# EAGLE design nrfusb (EAGLE 6.5.0)
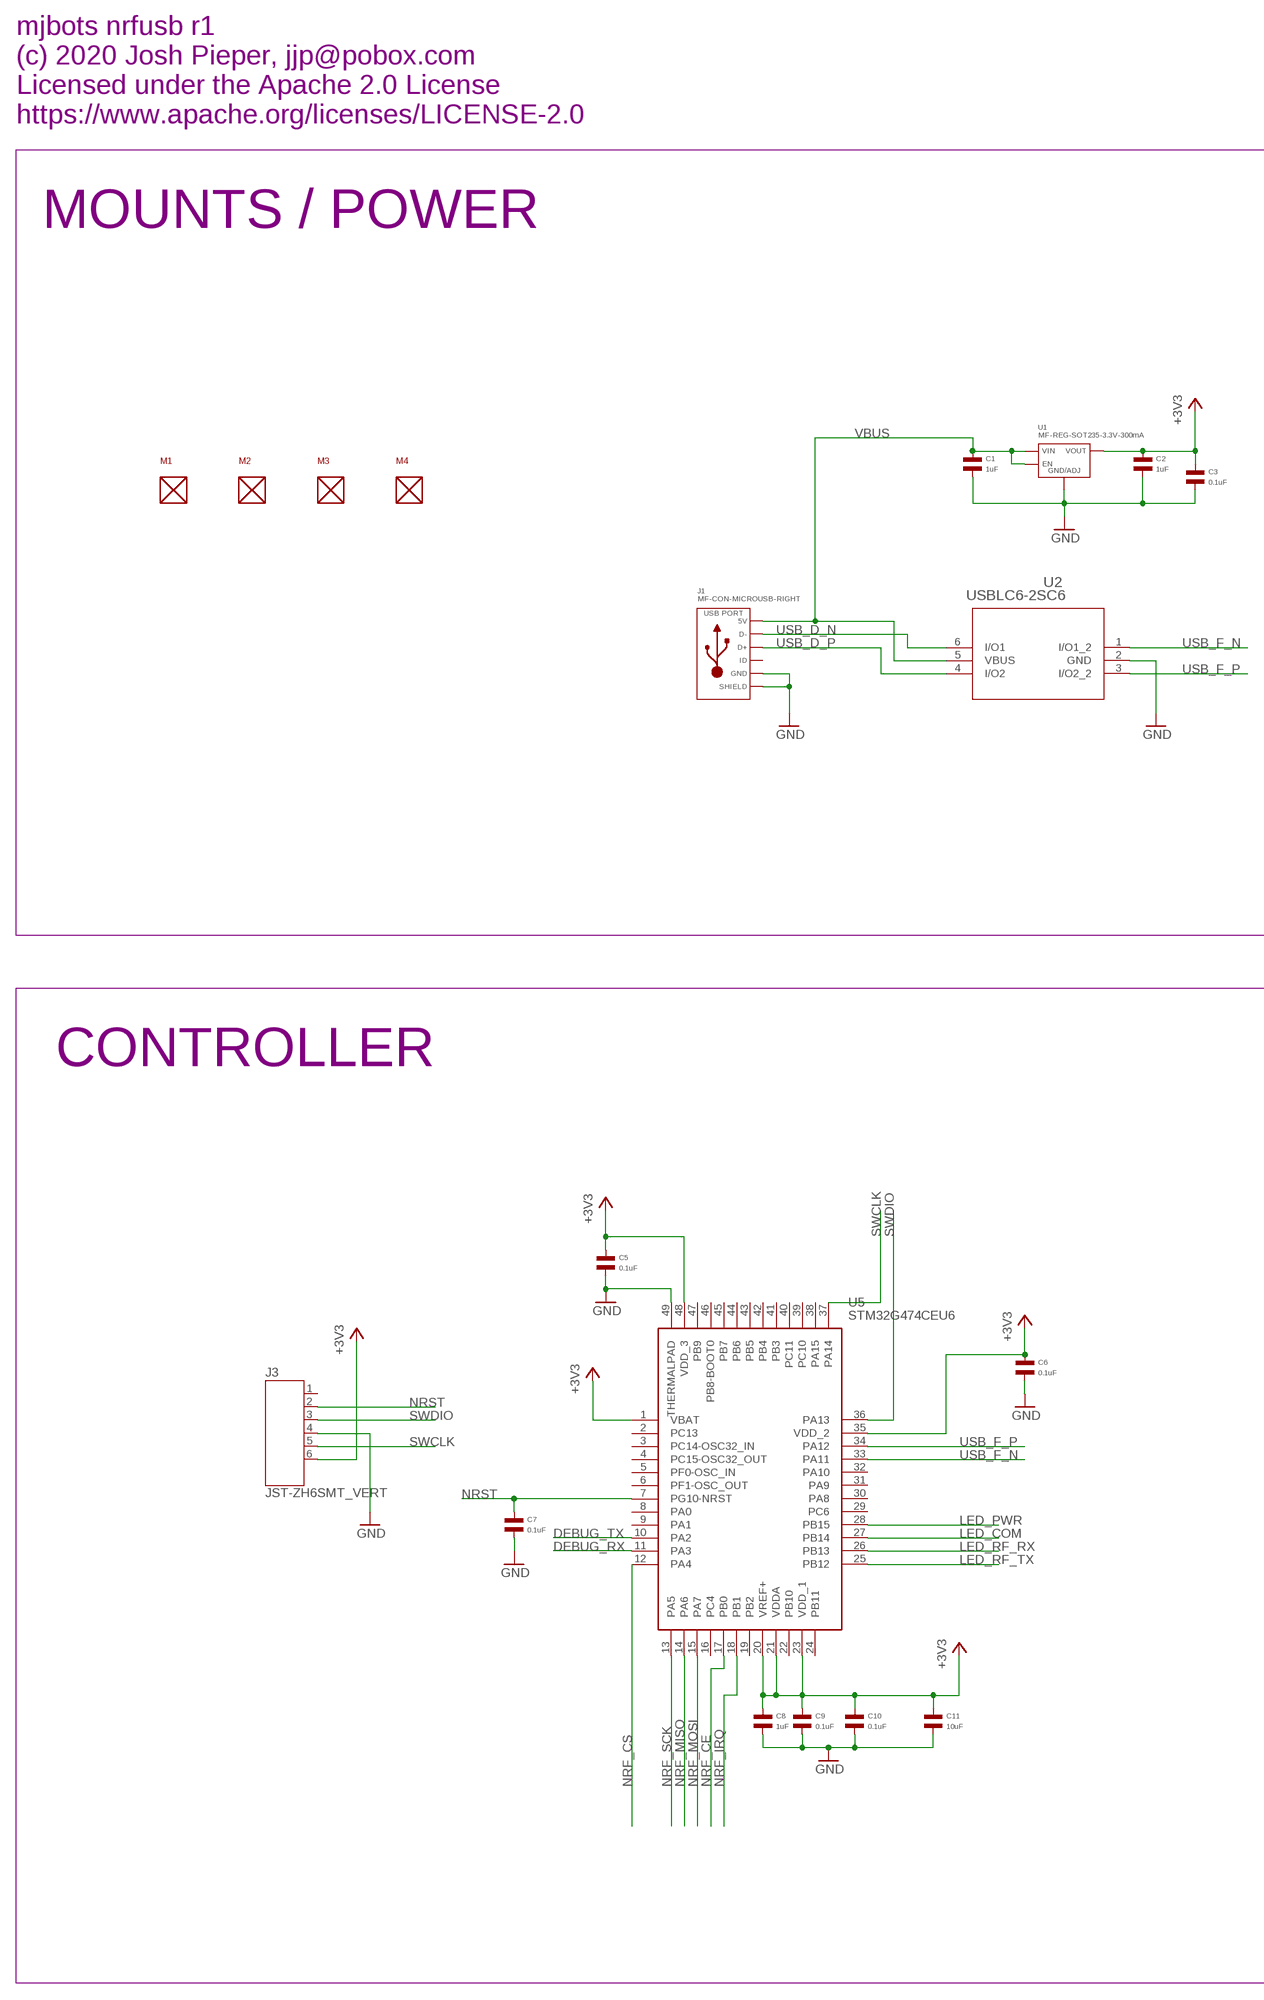
[diagram p0: schematic, sheet 1, part 1 of 2]
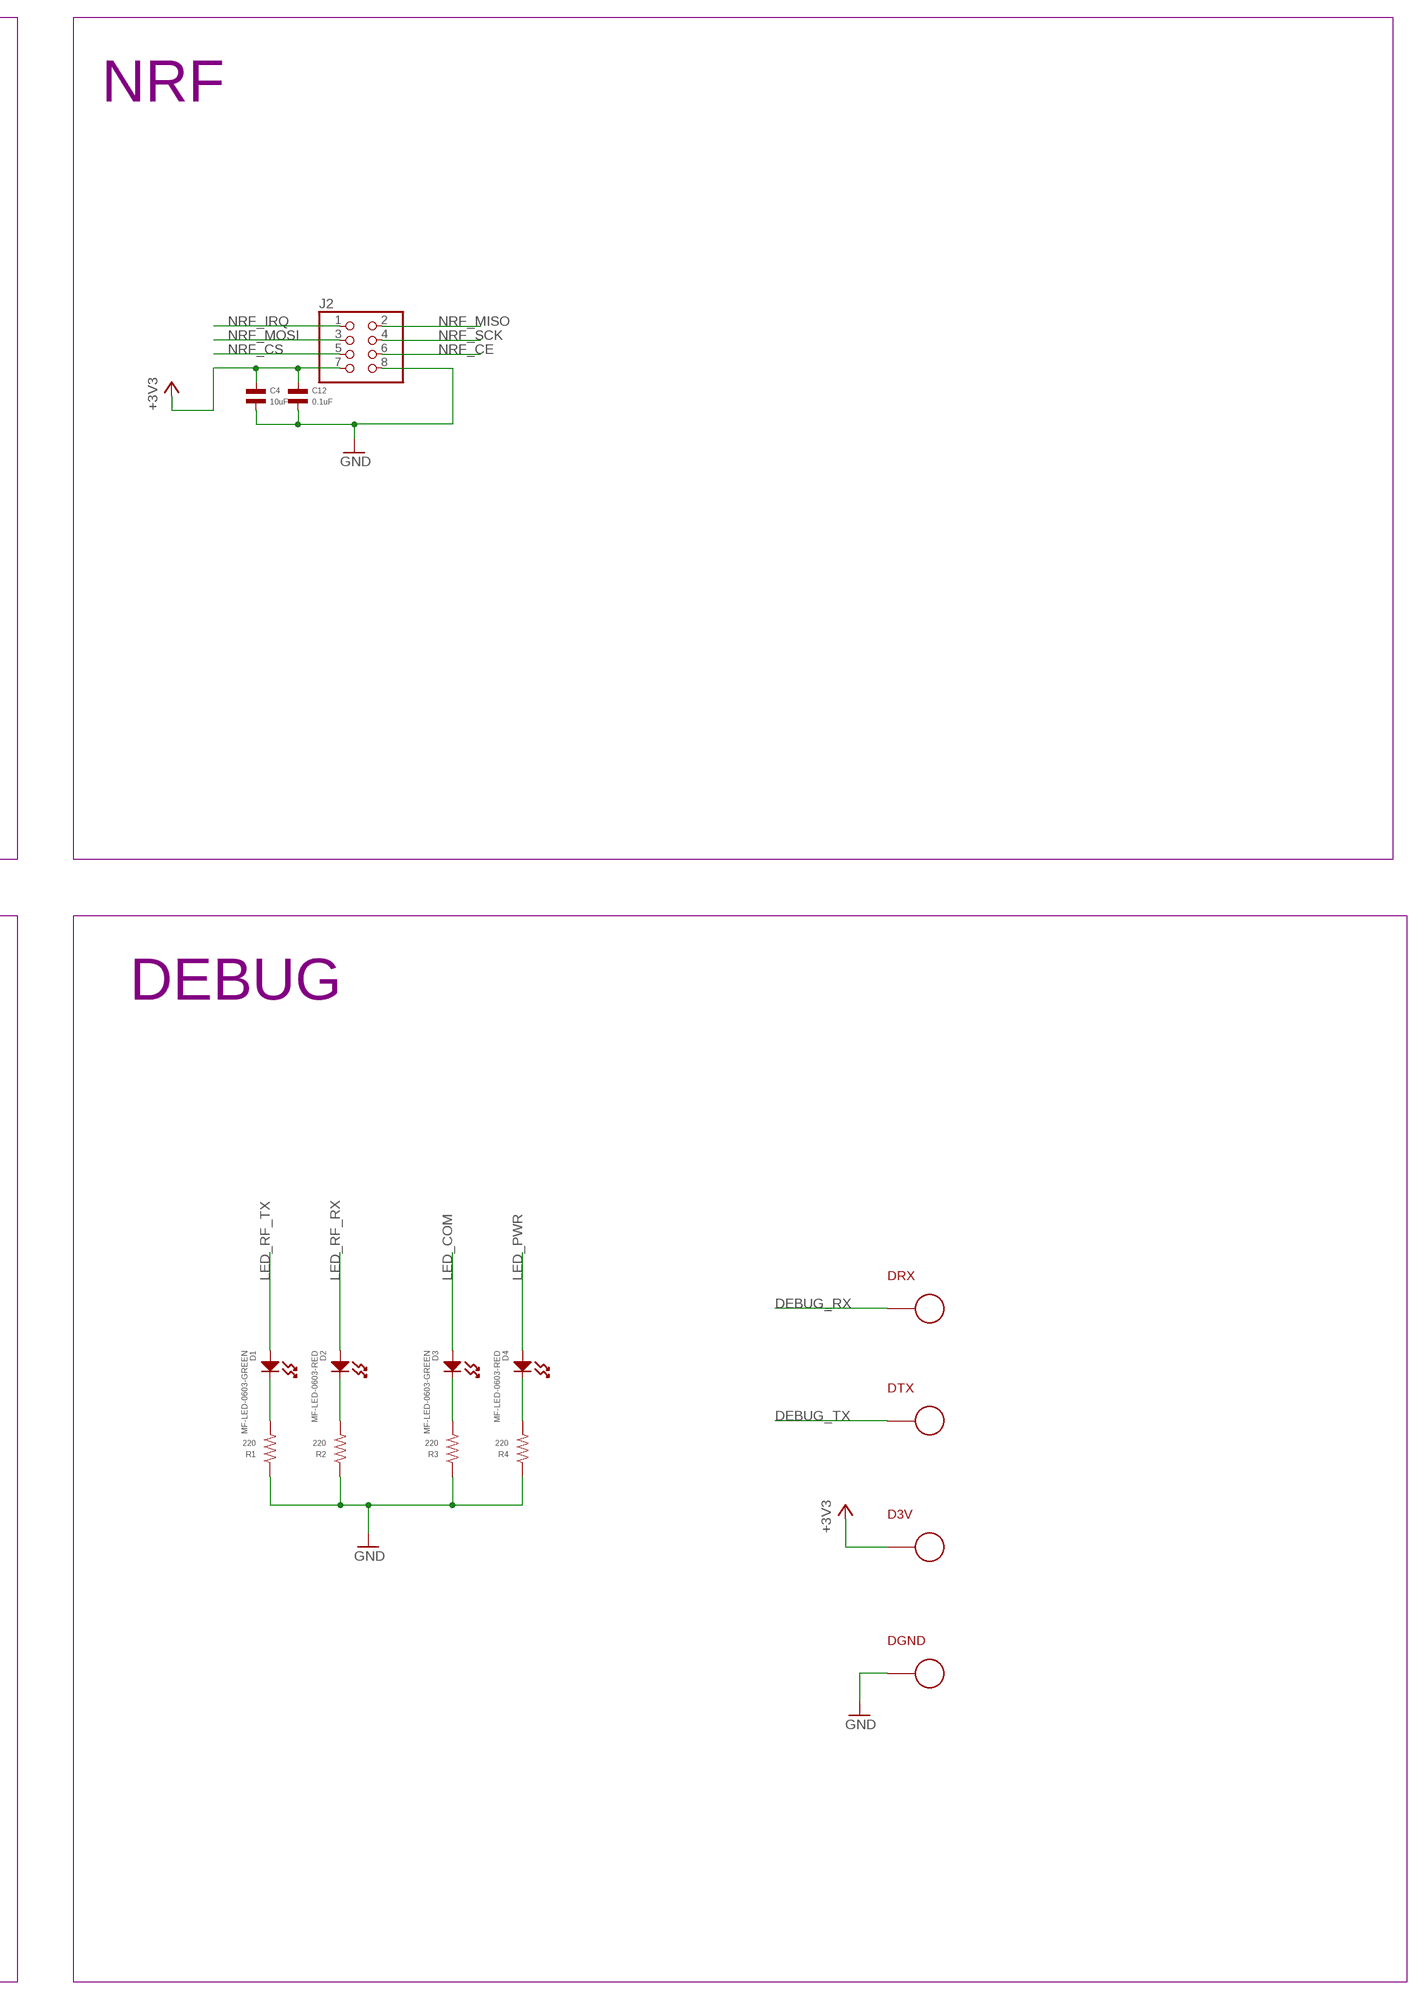
[diagram p1: schematic, sheet 1, part 2 of 2]

## Parts
C1  1uF  CAPACITOR_NP_0603  [C0603]
C2  1uF  CAPACITOR_NP_0603  [C0603]
C3  0.1uF  CAPACITOR_NP_0402  [C0402]
C4  10uF  CAPACITOR_NP_1206  [C1206]
C5  0.1uF  CAPACITOR_NP_0402  [C0402]
C6  0.1uF  CAPACITOR_NP_0402  [C0402]
C7  0.1uF  CAPACITOR_NP_0402  [C0402]
C8  1uF  CAPACITOR_NP_0603  [C0603]
C9  0.1uF  CAPACITOR_NP_0402  [C0402]
C10  0.1uF  CAPACITOR_NP_0402  [C0402]
C11  10uF  CAPACITOR_NP_1206  [C1206]
C12  0.1uF  CAPACITOR_NP_0402  [C0402]
D1  MF-LED-0603-GREEN  LED_SINGLE-0603-GREEN  [LED0603]
D2  MF-LED-0603-RED  LED_SINGLE-0603-RED  [LED0603]
D3  MF-LED-0603-GREEN  LED_SINGLE-0603-GREEN  [LED0603]
D3V  PAD24AWG_PAD  [24AWG_PAD]
D4  MF-LED-0603-RED  LED_SINGLE-0603-RED  [LED0603]
DGND  PAD24AWG_PAD  [24AWG_PAD]
DRX  PAD24AWG_PAD  [24AWG_PAD]
DTX  PAD24AWG_PAD  [24AWG_PAD]
J1  MF-CON-MICROUSB-RIGHT  USB_MICRO_RIGHT  [MICROUSB-RIGHT]
J2  PINHD-2X4  [2X04]
J3  JST-ZH6SMT_VERT  [JST_B6B-ZR-SM4-TF(LF)(SN)]
M1  MOUNT  [M2.5MOUNT]
M2  MOUNT  [M2.5MOUNT]
M3  MOUNT  [M2.5MOUNT]
M4  MOUNT  [M2.5MOUNT]
R1  220  RESISTOR_0402  [R0402]
R2  220  RESISTOR_0402  [R0402]
R3  220  RESISTOR_0402  [R0402]
R4  220  RESISTOR_0402  [R0402]
U1  MF-REG-SOT235-3.3V-300mA  TLV70233PDBVR  [SOT-23-5]
U2  USBLC6-2SC6  [SOT23-6L]
U5  STM32G474CEU6  [QFN50P700X700X60-49N]

## Nets
+3V3: C2.P$1 C3.P$1 C4.P$1 C5.P$1 C6.P$1 C8.P$1 C9.P$1 C10.P$1 C11.P$1 C12.P$1 D3V.P$1 J2.7 J3.6 U1.P$5(VOUT) U5.1(VBAT) U5.20(VREF+) U5.21(VDDA) U5.23(VDD_1) U5.35(VDD_2) U5.48(VDD_3)
DEBUG_RX: DRX.P$1 U5.11(PA3)
DEBUG_TX: DTX.P$1 U5.10(PA2)
GND: C1.P$2 C2.P$2 C3.P$2 C4.P$2 C5.P$2 C6.P$2 C7.P$2 C8.P$2 C9.P$2 C10.P$2 C11.P$2 C12.P$2 DGND.P$1 J1.5(GND) J1.S1(SLD) J1.S2(SLD) J1.S3(SLD) J1.S4(SLD) J1.S5(SLD) J1.S6(SLD) J2.8 J3.4 R1.P$1 R2.P$1 R3.P$1 R4.P$1 U1.P$2(GND/ADJ) U2.2(GND) U5.49(THERMALPAD)
LED_COM: D3.ANODE U5.27(PB14)
LED_PWR: D4.ANODE U5.28(PB15)
LED_RF_RX: D2.ANODE U5.26(PB13)
LED_RF_TX: D1.ANODE U5.25(PB12)
N$3: D1.CATHODE R1.P$2
N$4: D2.CATHODE R2.P$2
N$5: D3.CATHODE R3.P$2
N$6: D4.CATHODE R4.P$2
NRF_CE: J2.6 U5.17(PB0)
NRF_CS: J2.5 U5.12(PA4)
NRF_IRQ: J2.1 U5.18(PB1)
NRF_MISO: J2.2 U5.14(PA6)
NRF_MOSI: J2.3 U5.15(PA7)
NRF_SCK: J2.4 U5.13(PA5)
NRST: C7.P$1 J3.2 U5.7(PG10-NRST)
SWCLK: J3.5 U5.37(PA14)
SWDIO: J3.3 U5.36(PA13)
USB_D_N [usb]: J1.2(D-) U2.6(I/O1)
USB_D_P [usb]: J1.3(D+) U2.4(I/O2)
USB_F_N [usb]: U2.1(I/O1_2) U5.33(PA11)
USB_F_P [usb]: U2.3(I/O2_2) U5.34(PA12)
VBUS: C1.P$1 J1.1(5V) U1.P$1(VIN) U1.P$3(EN) U2.5(VBUS)
Unconnected: J1.4(ID) J3.1 U5.2(PC13) U5.3(PC14-OSC32_IN) U5.4(PC15-OSC32_OUT) U5.5(PF0-OSC_IN) U5.6(PF1-OSC_OUT) U5.8(PA0) U5.9(PA1) U5.16(PC4) U5.19(PB2) U5.22(PB10) U5.24(PB11) U5.29(PC6) U5.30(PA8) U5.31(PA9) U5.32(PA10) U5.38(PA15) U5.39(PC10) U5.40(PC11) U5.41(PB3) U5.42(PB4) U5.43(PB5) U5.44(PB6) U5.45(PB7) U5.46(PB8-BOOT0) U5.47(PB9)

## Notes on the sheet
- mjbots nrfusb r1
  (c) 2020 Josh Pieper, jjp@pobox.com
  Licensed under the Apache 2.0 License
  https://www.apache.org/licenses/LICENSE-2.0
- MOUNTS / POWER | NRF
- CONTROLLER | DEBUG

## Library data of the parts
C1 C2 C8 = mfpassives:CAPACITOR_NP: Library: MF_Passives Description: Device for Non-Polarized Capacitors. Manufacture part number (MPN) can be added via Attributes. Check https://factory.macrofab.com/parts for the house parts list.; HOUSEPART: YES; MPN: MF-CAP-0603-1uF; POPULATE: 1
C3 C5-C7 C9 C10 C12 = mfpassives:CAPACITOR_NP: Library: MF_Passives Description: Device for Non-Polarized Capacitors. Manufacture part number (MPN) can be added via Attributes. Check https://factory.macrofab.com/parts for the house parts list.; HOUSEPART: YES; MPN: MF-CAP-0402-0.1uF; POPULATE: 1
C4 C11 = mfpassives:CAPACITOR_NP: Library: MF_Passives Description: Device for Non-Polarized Capacitors. Manufacture part number (MPN) can be added via Attributes. Check https://factory.macrofab.com/parts for the house parts list.; HOUSEPART: YES; MPN: MF-CAP-1206-10uF; POPULATE: 1
D1 D3 = mfleds:LED_SINGLE: Library: MF_LEDs Description: Device for Single LED Packages. Manufacture part number (MFG#) can be added via Attributes.; HOUSEPART: YES; MPN: MF-LED-0603-GREEN; POPULATE: 1; URL: https://factory.macrofab.com/part/MF-LED-0603-GREEN
D2 D4 = mfleds:LED_SINGLE: Library: MF_LEDs Description: Device for Single LED Packages. Manufacture part number (MFG#) can be added via Attributes.; HOUSEPART: YES; MPN: MF-LED-0603-RED; POPULATE: 1; URL: https://factory.macrofab.com/part/MF-LED-0603-RED
D3V DGND DRX DTX = fdcanusb:PAD; POPULATE: 0
J1 = mfconnectors:USB: Library: MF_Connectors Description: 5 Pin USB Connectors. SLD is the shield connection. Usually tied to ground through a small ferrite bead.; HOUSEPART: YES; MPN: MF-CON-MICROUSB-RIGHT; POPULATE: 1; URL: https://factory.macrofab.com/part/MF-CON-MICROUSB-RIGHT
J2 = pinhead:PINHD-2X4: PIN HEADER; MF: WURTH; MPN: 61300821121; POPULATE: 1
J3 = fdcanusb:JST-ZH6; MF: JST; MPN: B6B-ZR-SM4-TF(LF)(SN); POPULATE: 1
M1-M4 = fdcanusb:MOUNT; POPULATE: 0
R1-R4 = mfpassives:RESISTOR: Library: MF_Passives Description: Device for Resistors. Manufacture part number (MPN), Voltage, Tolerance, and Wattage Rating can be added via Attributes. Check https://factory.macrofab.com/parts for the house parts list.; MPN: MF-RES-0402-220; POPULATE: 1
U1 = mficpower:TLV702: Manufacturer Part #: TLV702 Manufacturer: Texas Instruments Description: LDO Voltage Regulators; HOUSEPART: YES; MPN: MF-REG-SOT235-3.3V-300mA; POPULATE: 1; URL: https://factory.macrofab.com/part/MF-REG-SOT235-3.3V-300mA
U2 = fdcanusb:USBLC6-2SC6; MANUFACTURER_PART_NUMBER: USBLC62SC6; MF: ST; MPN: USBLC6-2SC6; POPULATE: 1; VENDOR: STMicroelectronics
U5 = nrfusb:STM32G474CEU6: STMICROELECTRONICS - STM32G474CEU6 - MCU, 32BIT, 170MHZ, UFQFPN-48 Source: Datasheet <https://componentsearchengine.com/Datasheets/1/STM32G474CEU6.pdf>; DESCRIPTION: STMICROELECTRONICS - STM32G474CEU6 - MCU, 32BIT, 170MHZ, UFQFPN-48; HEIGHT: 0.6mm; MANUFACTURER_NAME: STMicroelectronics; MANUFACTURER_PART_NUMBER: STM32G474CEU6; MF: ST; MOUSER_PART_NUMBER: 511-STM32G474CEU6; MOUSER_PRICE-STOCK: https://www.mouser.com/Search/Refine.aspx?Keyword=511-STM32G474CEU6; MPN: STM32G474CEU6; POPULATE: 1

## Net classes
1 usb: width 0.305 mm, clearance 0.127 mm
2 can: width 0.216 mm, clearance 0.127 mm

## Board
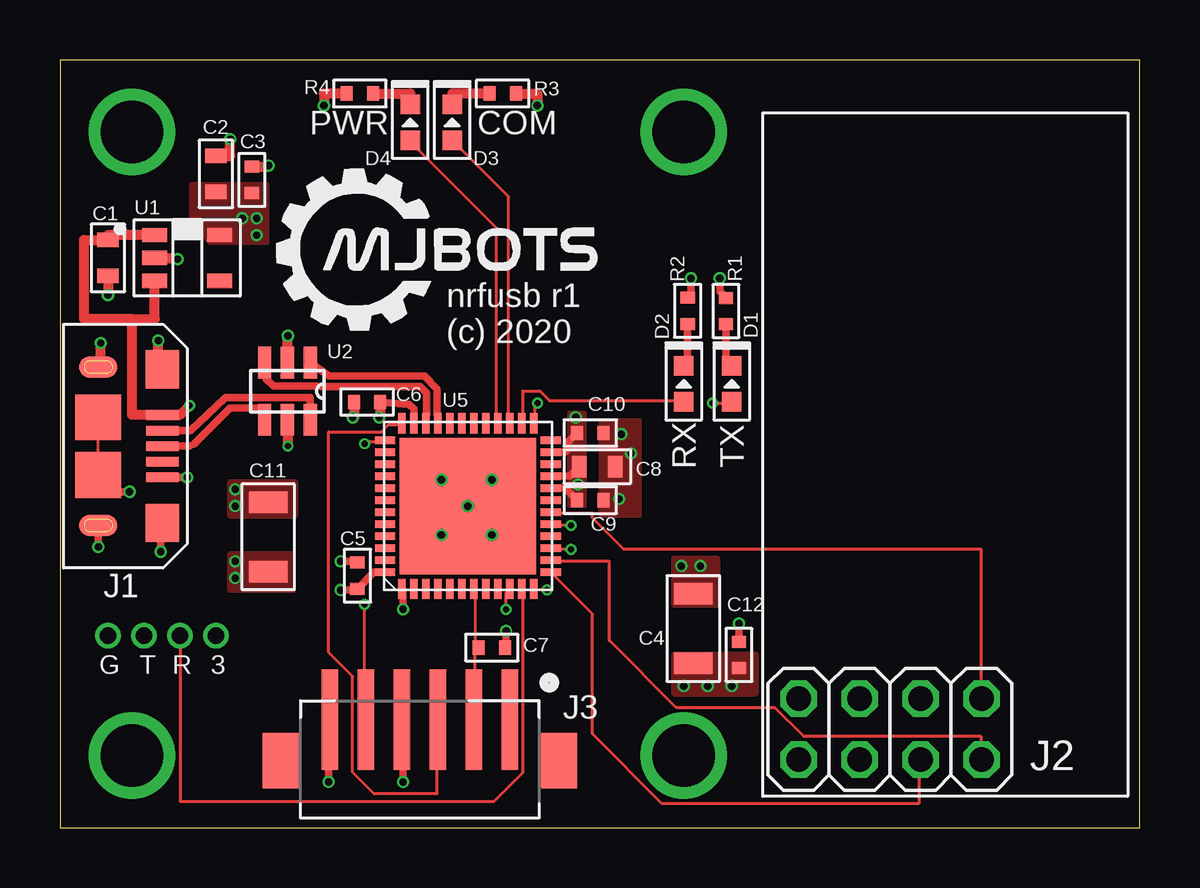
[diagram p2: board, top side]
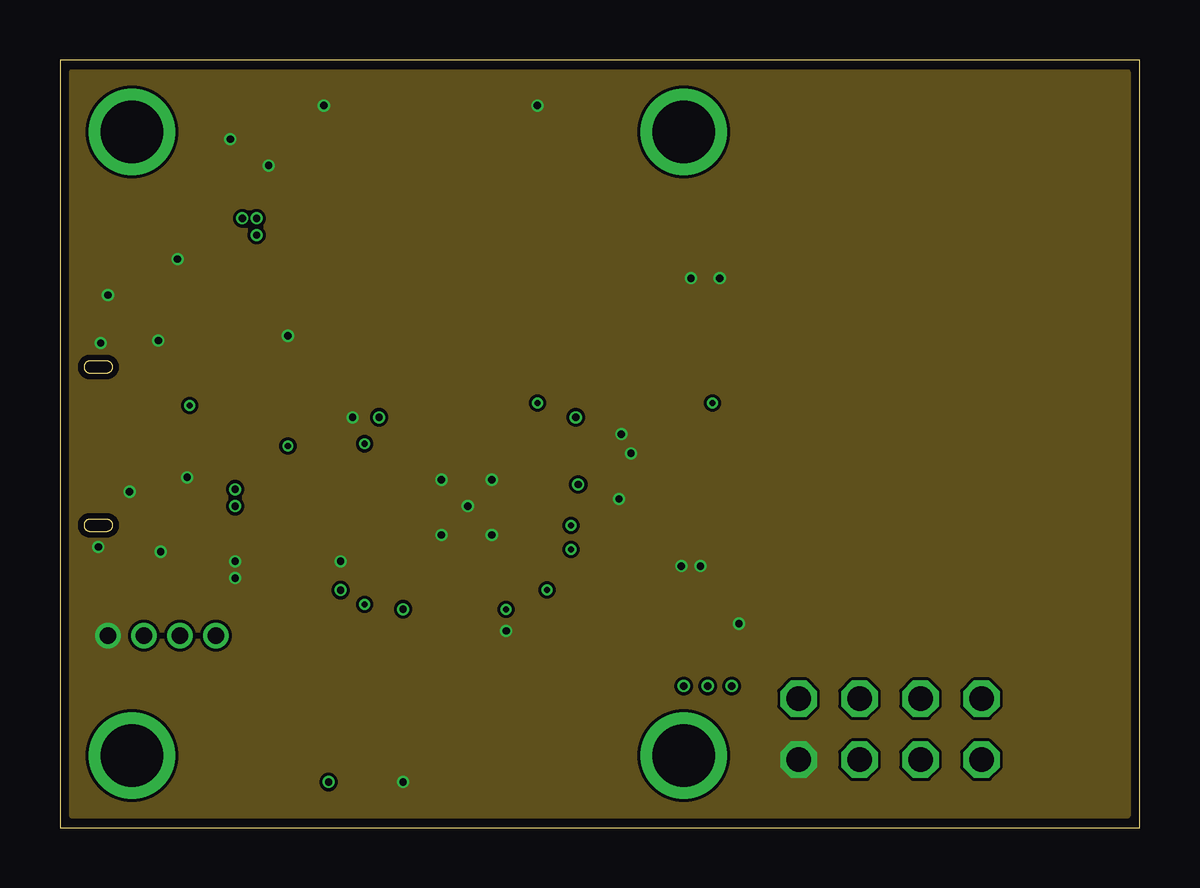
[diagram p3: board, inner layer Route2]
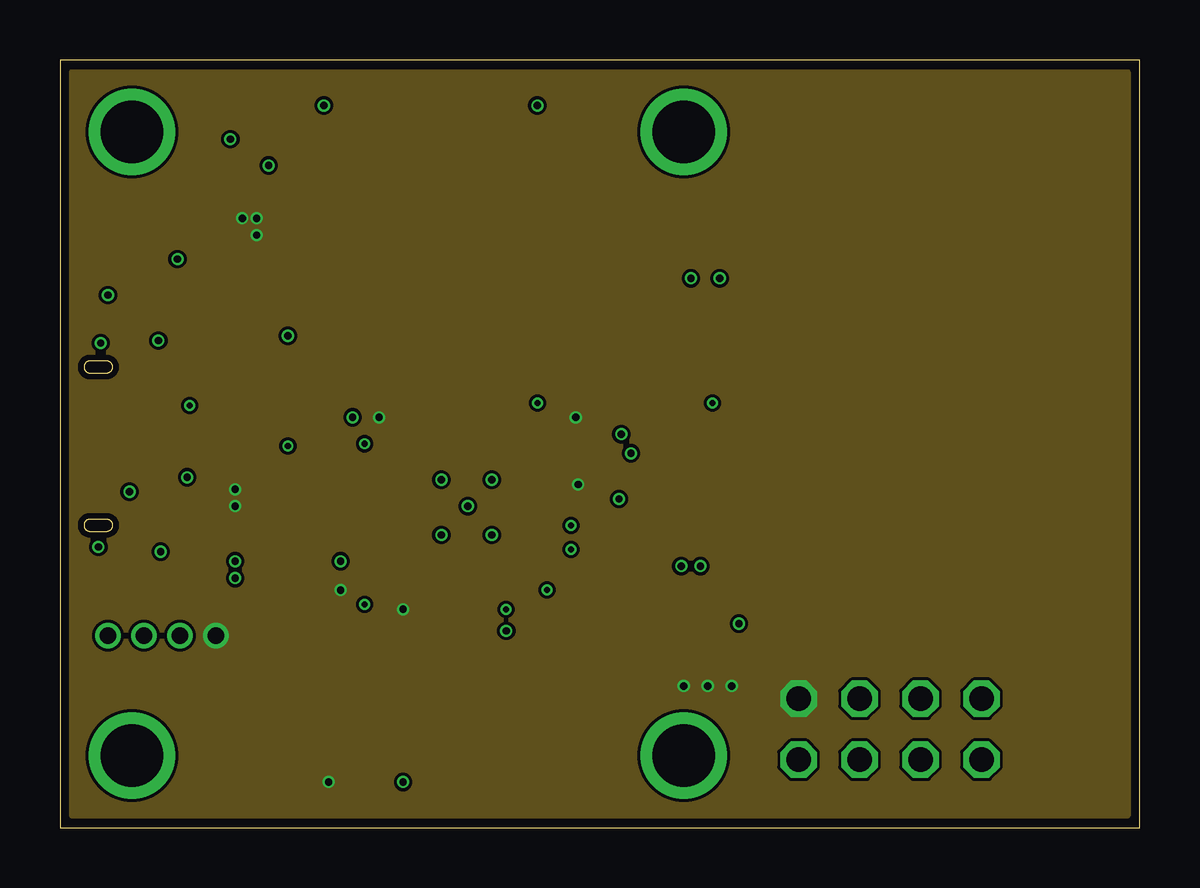
[diagram p4: board, inner layer Route15]
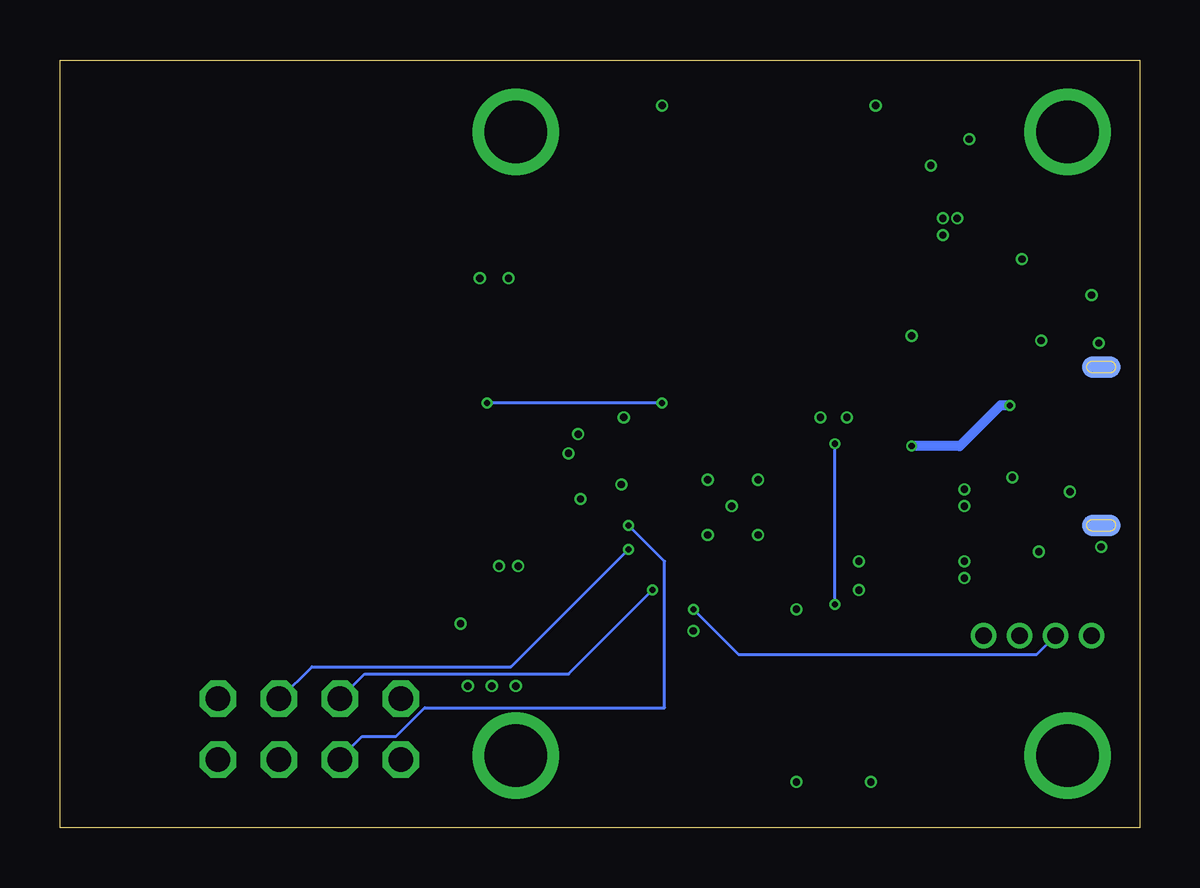
[diagram p5: board, bottom side, seen from below]

Size 45 x 32 mm. Coordinates in mm from the lower left corner, seen from the top.
Outline: 0,0 45,0 45,32 0,32 0,0
Copper layers (1*2*15*16): Top 0.035mm / dielectric 0.23mm / Route2 0.035mm / dielectric 0.93mm / Route15 0.035mm / dielectric 0.23mm / Bottom 0.035mm
Design rules "MF_Standard_4_Layer": minimum track width 5mil, minimum drill 10mil, track to track 5mil, track to pad 5mil, pad to pad 5mil, via to via 5mil, smd to smd 0mil, copper to edge 10mil, drill to drill 10mil, minimum pad ring 4mil, minimum via ring 4mil, stop-mask expansion 2mil, vias tented up to drill 25mil, thermal gap 10mil

### Footprints (pad centres in the part's own frame; a part is rotated, then mirrored left to right if it is on the bottom)
C0603 = smd 0.6 x 0.9: P$1 -0.75,0; P$2 0.75,0
C0402 = smd 0.5 x 0.6: P$1 -0.55,0; P$2 0.55,0
C1206 = smd 0.9 x 1.6: P$1 -1.45,0; P$2 1.45,0
LED0603 = smd 0.8 x 0.8: ANODE 0.75,0; CATHODE -0.75,0
24AWG_PAD = drill 0.7: P$1 0,0
MICROUSB-RIGHT = smd 0.4 x 1.35: 1 -1.3,1.27; 2 -0.65,1.27; 3 0,1.27; 4 0.65,1.27; 5 1.3,1.27 | smd 0.9 x 1.6: S1 -3.3,-1.4; S2 3.3,-1.4 | smd 1.6 x 1.4: S3 -3.2,1.27; S4 3.2,1.27 | smd 1.9 x 1.9: S5 -1.2,-1.405; S6 1.2,-1.405 | smd 0.9 x 1.6 bottom: S7 -3.3,-1.4; S8 3.3,-1.4
2X04 = drill 1.016 octagon: 1 -3.81,-1.27; 2 -3.81,1.27; 3 -1.27,-1.27; 4 -1.27,1.27; 5 1.27,-1.27; 6 1.27,1.27; 7 3.81,-1.27; 8 3.81,1.27
JST_B6B-ZR-SM4-TF(LF)(SN) = smd 0.7 x 4.2: 1 -3.75,-2; 2 -2.25,-2; 3 -0.75,-2; 4 0.75,-2; 5 2.25,-2; 6 3.75,-2 | smd 1.5 x 2.3: P1 -5.8,-0.29; P2 5.8,-0.29
M2.5MOUNT = drill 2.6: P$1 0,0
R0402 = smd 0.5 x 0.6: P$1 -0.55,0; P$2 0.55,0
SOT-23-5 = smd 1.05 x 0.6: P$1 -1.35,0.95; P$2 -1.35,0; P$3 -1.35,-0.95; P$4 1.35,-0.95; P$5 1.35,0.95
SOT23-6L = smd 1.321 x 0.559: 1 -1.194,0.95; 2 -1.194,0; 3 -1.194,-0.95; 4 1.194,-0.95; 5 1.194,0; 6 1.194,0.95
QFN50P700X700X60-49N = smd 0.85 x 0.3: 1 -3.45,2.75; 2 -3.45,2.25; 3 -3.45,1.75; 4 -3.45,1.25; 5 -3.45,0.75; 6 -3.45,0.25; 7 -3.45,-0.25; 8 -3.45,-0.75; 9 -3.45,-1.25; 10 -3.45,-1.75; 11 -3.45,-2.25; 12 -3.45,-2.75; 25 3.45,-2.75; 26 3.45,-2.25; 27 3.45,-1.75; 28 3.45,-1.25; 29 3.45,-0.75; 30 3.45,-0.25; 31 3.45,0.25; 32 3.45,0.75; 33 3.45,1.25; 34 3.45,1.75; 35 3.45,2.25; 36 3.45,2.75 | smd 0.3 x 0.85: 13 -2.75,-3.45; 14 -2.25,-3.45; 15 -1.75,-3.45; 16 -1.25,-3.45; 17 -0.75,-3.45; 18 -0.25,-3.45; 19 0.25,-3.45; 20 0.75,-3.45; 21 1.25,-3.45; 22 1.75,-3.45; 23 2.25,-3.45; 24 2.75,-3.45; 37 2.75,3.45; 38 2.25,3.45; 39 1.75,3.45; 40 1.25,3.45; 41 0.75,3.45; 42 0.25,3.45; 43 -0.25,3.45; 44 -0.75,3.45; 45 -1.25,3.45; 46 -1.75,3.45; 47 -2.25,3.45; 48 -2.75,3.45 | smd 5.7 x 5.7: 49 0,0

### Placement (x,y rotation side)
C1  2,23.75 270 top
C2  6.5,27.25 90 top
C3  8,27 90 top
C4  26.4,8.3 90 top
C5  12.4,10.5 90 top
C6  12.8,17.74 180 top
C7  18,7.5 0 top
C8  22.4,15.05 0 top
C9  22.1,13.65 0 top
C10  22.1,16.45 0 top
C11  8.68,12.12 270 top
C12  28.3,7.2 90 top
D1  28,18.5 270 top
D2  26,18.5 270 top
D3  16.35,29.4 270 top
D3V  6.5,8 0 top
D4  14.6,29.4 270 top
DGND  2,8 0 top
DRX  5,8 0 top
DTX  3.5,8 0 top
J1  3,15.9 270 top
J2  34.6,4.1 180 top
J3  15,2.5 180 top
M1  26,3 0 top
M2  26,29 0 top
M3  3,3 0 top
M4  3,29 0 top
R1  27.76,21.53 270 top
R2  26.16,21.54 270 top
R3  18.45,30.6 180 top
R4  12.5,30.6 0 top
U1  5.3,23.75 0 top
U2  9.48,18.19 270 top
U5  17,13.4 90 top

### Tracks (layer width: path | path; a pad name or v marks a point on that pad's centre or on a via)
+3V3  (via drill 0.3)
  Top 0.305: C6.P$1 14.56,17.64 14.75,17.45 U5.35 | J3.6 11.2,4.45 v11.2,1.9 | v11.7,9.9 12.35,9.9 C5.P$1 13.1,10.65 U5.48 | U5.1 14.3,9.9 v14.3,9.1 | U5.23 21.05,15.65 21.2,15.8 21.2,16.1 C10.P$1 | U5.21 21.25,14.65 C8.P$1 | U5.20 21.05,14.15 C9.P$1
  Top 0.406: C6.P$1 13.35,17.05 v13.3,17.1
  other vias: 8.2,25.4 8.2,24.7 7.6,25.4 7.3,14.1 7.3,13.4 26,5.9 27,5.9 28,5.9 21.5,17.1 21.6,14.3
  pour Route15 (no thermals): 0.5,31.5 44.5,31.5 44.5,0.5 0.5,0.5
  pour Top (no thermals): 5.5,26.8 8.6,26.8 8.6,24.4 6.3,24.4 5.5,25.2
  pour Top (no thermals): 7.1,13 7.1,14.4 9.8,14.4 9.8,13
  pour Top (no thermals): 25.6,7.2 25.6,5.6 29,5.6 29,7.2
  pour Top (no thermals): 21.2,17.3 21.2,13.4 21.9,13.4 21.9,17.3
DEBUG_RX
  Top 0.127: DRX.P$1 5,1.1 18.1,1.1 19.3,2.3 19.3,9.9 U5.11
DEBUG_TX  (via drill 0.25)
  Top 0.127: U5.10 18.6,9.8 v18.6,9.1
  Bottom 0.127: v18.6,9.1 16.7,7.2 4.3,7.2 DTX.P$1
GND  (via drill 0.3)
  Top 0.127: J1.S5 1.6,14.8 J1.S6
  Top 0.305: v1.6,11.7 J1.S2 | J1.S4 4.2,12.63 v4.2,11.5 | J1.S6 2.29,14 v2.9,14 | J1.5 v5.3,14.6 | J3.4 14.3,4.45 v14.3,1.9 | C7.P$2 18.6,7.55 v18.6,8.2 | C5.P$2 12.35,11.1 v11.7,11.1 | R2.P$1 26.3,22.23 v26.3,22.9 | R1.P$1 27.5,22.34 v27.5,22.9 | C12.P$2 v28.3,8.5
  Top 0.406: C1.P$2 v2,22.2 | U1.P$2 4.9,23.75 v4.9,23.7 | J1.S1 1.7,19.2 v1.7,20.2 | J1.S3 4.1,19.1 v4.1,20.3 | C2.P$2 7.1,28 v7.1,28.7 | C3.P$2 8.7,27.55 v8.7,27.6 | R4.P$1 11,30.6 v11,30.1 | R3.P$1 19.9,30.6 v19.9,30.1 | U2.2 9.48,20.48 v9.5,20.5 | C6.P$2 12.25,17.05 v12.2,17.1
  other vias: 7.3,11.1 7.3,10.4 17,13.4 15.9,14.5 18,14.5 18,12.2 15.9,12.2 23.3,13.7 23.4,16.4 23.8,15.6 25.9,10.9 26.7,10.9
  pour Route2 (no thermals): 0.5,31.5 44.5,31.5 44.5,0.5 0.5,0.5
  pour Top (no thermals): 7.1,9.9 7.1,11.4 9.7,11.4 9.7,9.9
  pour Top (no thermals): 25.6,11.2 25.6,9.3 27.4,9.3 27.4,11.2
  pour Top (no thermals): 22.5,17 22.5,13 24.2,13 24.2,17
LED_COM
  Top 0.127: D3.ANODE 18.7,26.3 18.7,16.9 U5.27
LED_PWR
  Top 0.127: D4.ANODE 14.6,28.6 18.2,25 18.2,16.9 U5.28
LED_RF_RX
  Top 0.127: D2.ANODE 26,17.8 20.4,17.8 20,18.2 19.3,18.2 19.3,16.9 U5.26
LED_RF_TX  (via drill 0.25)
  Top 0.127: v27.2,17.7 28,17.7 D1.ANODE | v19.9,17.7 19.8,17.6 19.8,16.9 U5.25
  Bottom 0.127: v19.9,17.7 v27.2,17.7
N$3
  Top 0.305: D1.CATHODE 27.76,19.49 R1.P$2
N$4
  Top 0.305: D2.CATHODE 26.16,19.41 R2.P$2
N$5
  Top 0.406: R3.P$2 16.35,30.6 D3.CATHODE
N$6
  Top 0.406: R4.P$2 14.6,30.6 D4.CATHODE
NRF_CE  (via drill 0.25)
  Top 0.127: v21.3,12.6 20.5,12.6 U5.17
  Bottom 0.127: v21.3,12.6 19.8,11.1 19.8,5 29.8,5 31,3.8 32.4,3.8 33.3,2.9 J2.6
NRF_CS  (via drill 0.25)
  Top 0.127: v20.3,9.9 19.8,9.9 U5.12
  Bottom 0.127: v20.3,9.9 23.8,6.4 32.3,6.4 J2.5
NRF_IRQ
  Top 0.127: U5.18 20.5,13.1 22.2,13.1 22.2,12.9 23.5,11.6 38.4,11.6 38.4,5.4 J2.1
NRF_MISO
  Top 0.127: U5.14 20.5,11.1 22.9,11.1 22.9,7.8 25.7,5 29.8,5 31,3.8 38.4,3.8 38.4,2.9 J2.2
NRF_MOSI  (via drill 0.25)
  Top 0.127: v21.3,11.6 20.5,11.6 U5.15
  Bottom 0.127: v21.3,11.6 26.2,6.7 34.5,6.7 35.8,5.4 J2.3
NRF_SCK
  Top 0.127: U5.13 22.2,8.9 22.2,3.9 25.1,1 35.8,1 35.8,2.8 J2.4
NRST
  Top 0.127: 17.4,7.5 17.3,7.6 17.3,9.9 U5.7 | 17.4,7.5 17.3,7.4 17.3,4.5 J3.2 | 17.4,7.5 C7.P$1
SWCLK  (via drill 0.25)
  Top 0.127: v12.7,16 12.7,16.1 13.5,16.1 U5.37 | v12.7,9.3 12.7,4.5 J3.5
  Bottom 0.127: v12.7,9.3 v12.7,16
SWDIO
  Top 0.127: U5.36 14.2,16.8 13.7,16.8 13.4,16.5 11.2,16.5 11.2,7.3 12.2,6.3 12.2,2.3 13.1,1.4 15.7,1.4 15.7,4.5 J3.3
USB_D_N
  Top 0.305: J1.2 5.37,16.55 5.46,16.56 6.91,17.94 10.43,17.94 U2.6
USB_D_P
  Top 0.305: J1.3 5.42,15.9 5.6,15.98 5.65,16.04 5.65,16.05 7.09,17.48 8.53,17.48 U2.4
USB_F_N
  Top 0.305: U2.1 11.21,18.82 15.19,18.82 15.72,18.29 15.72,17.2 15.75,17.17 U5.33
USB_F_P
  Top 0.305: U2.3 8.6,19.31 8.6,18.7 8.9,18.4 10.7,18.4 10.9,18.38 15.01,18.38 15.28,18.11 15.28,17.2 15.25,17.17 U5.34
VBUS  (via drill 0.25)
  Top 0.406: 3,21.2 3,17.2 J1.1 5,17.2 v5.4,17.6 | 3,21.2 1,21.2 1,24.5 C1.P$1 2,24.7 U1.P$1 | 3,21.2 3.95,21.2 U1.P$3 | v9.5,15.9 9.5,16.98 U2.5
  Bottom 0.406: v5.4,17.6 5.8,17.6 7.5,15.9 v9.5,15.9

### Text on the board
tPlace: PWR | COM | nrfusb r1 / (c) 2020 | RX | TX | G | T | R | 3